# Altium schematic sheet stc-mainboard.SchDoc
size A1
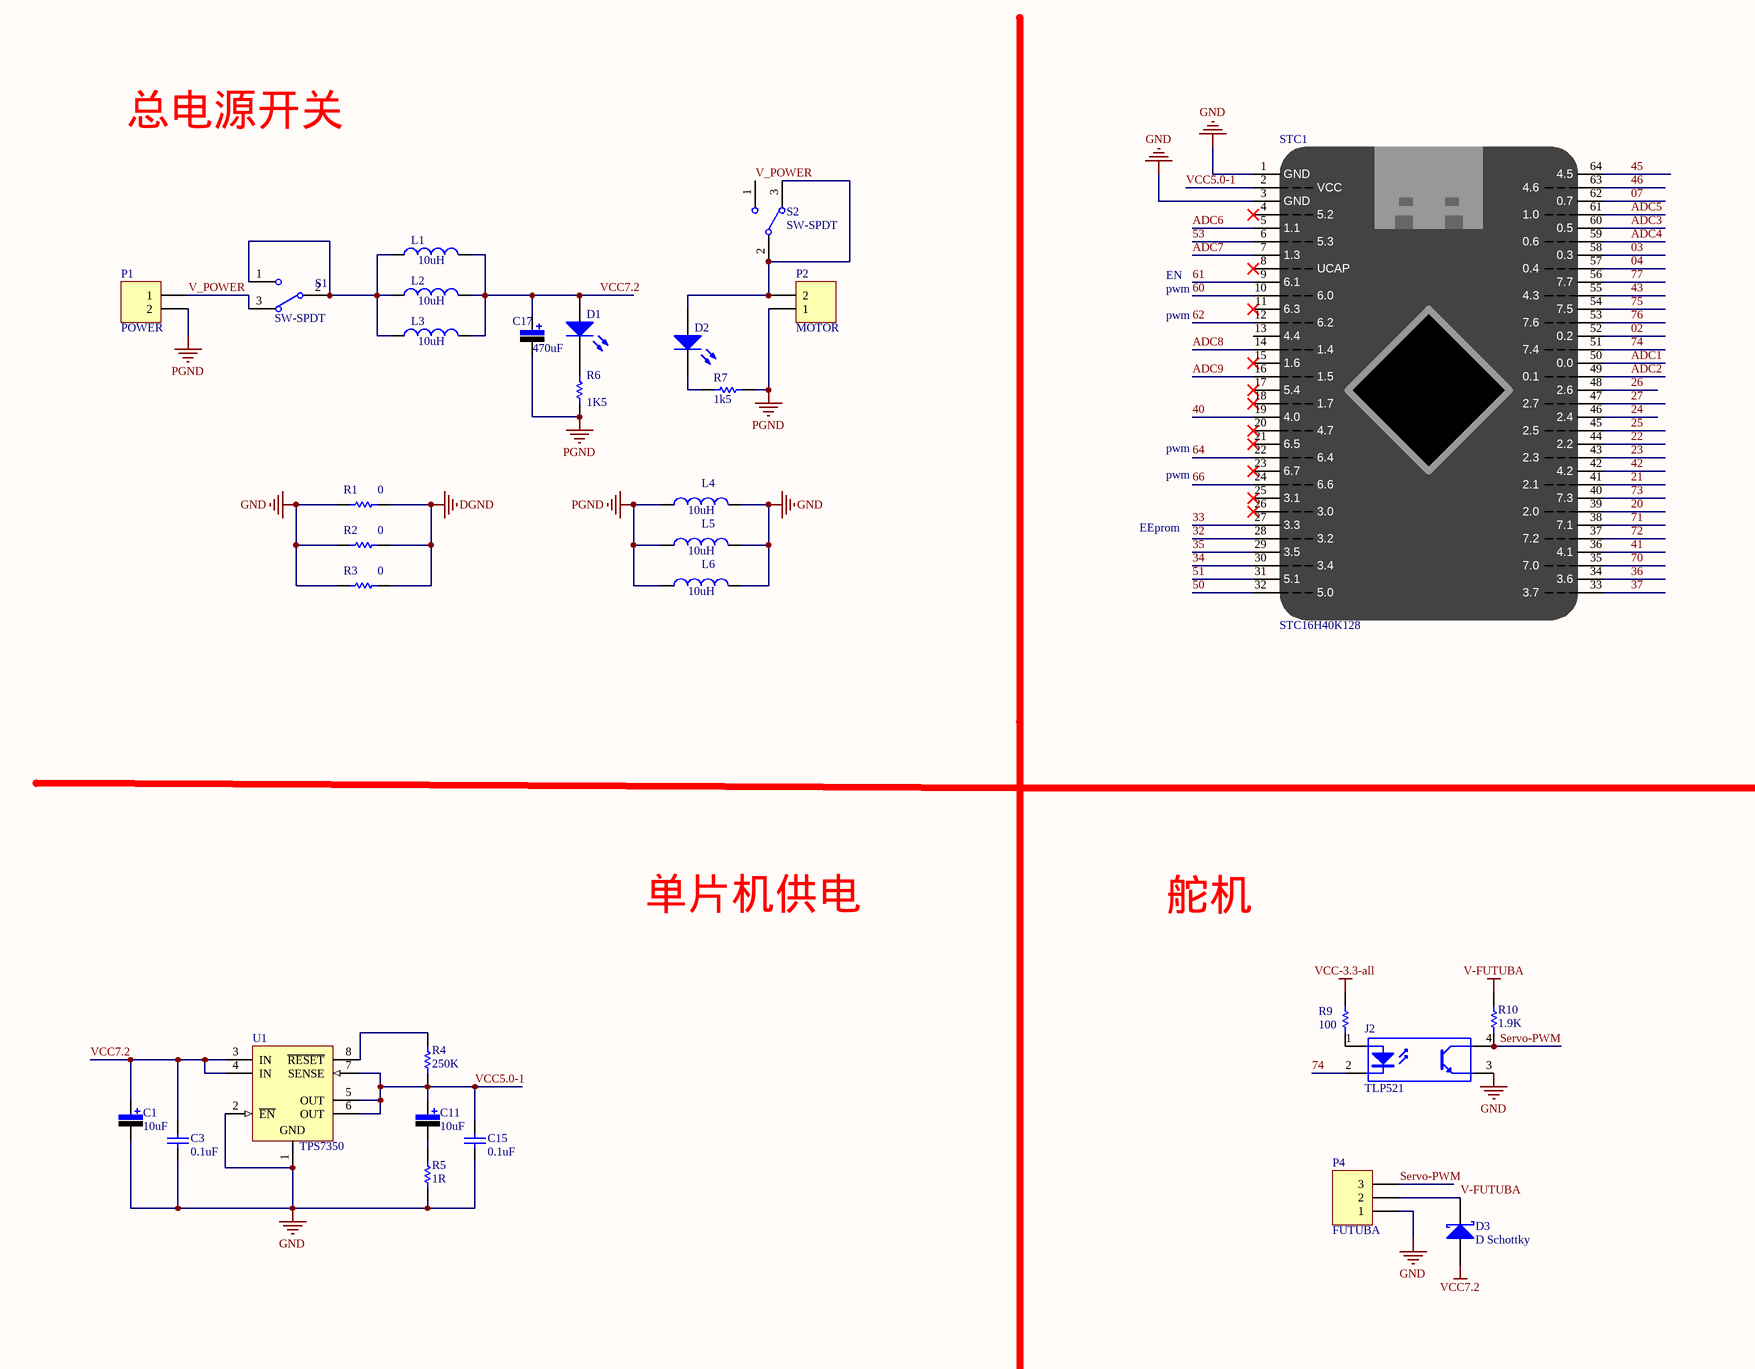
[diagram p0: stc-mainboard.SchDoc, top left]
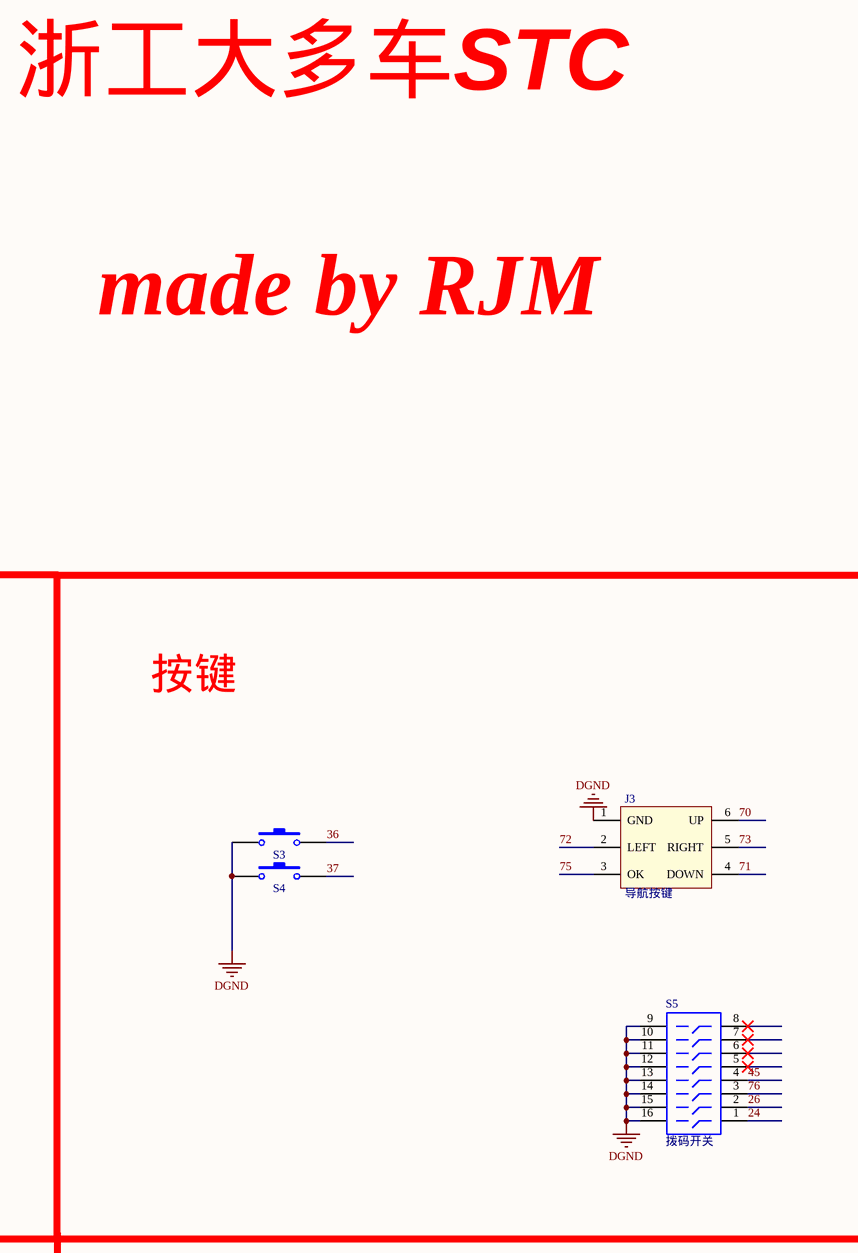
[diagram p1: stc-mainboard.SchDoc, top right]
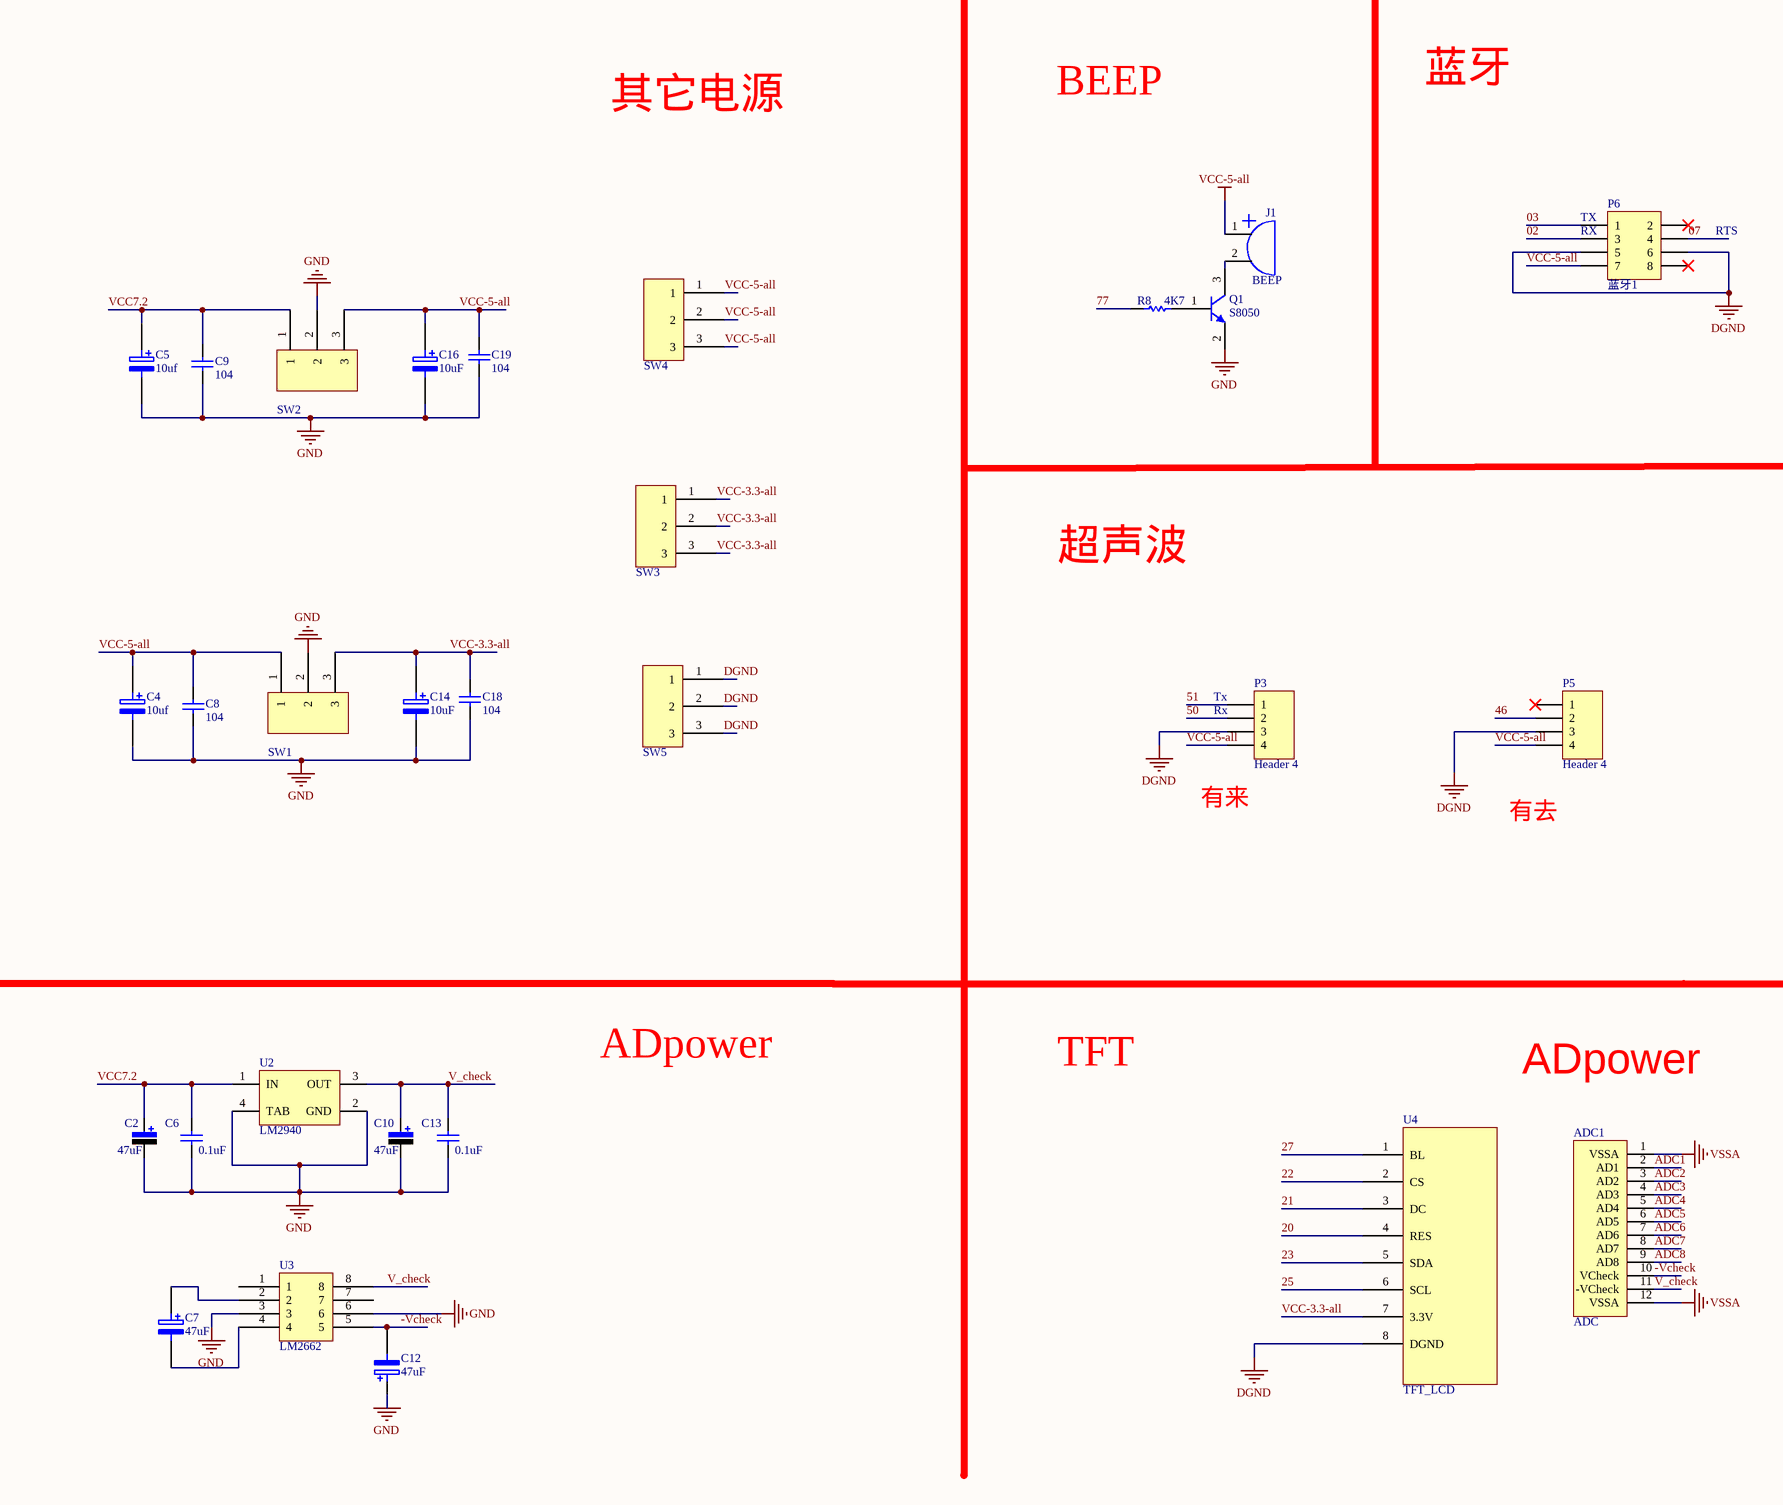
[diagram p2: stc-mainboard.SchDoc, bottom left]
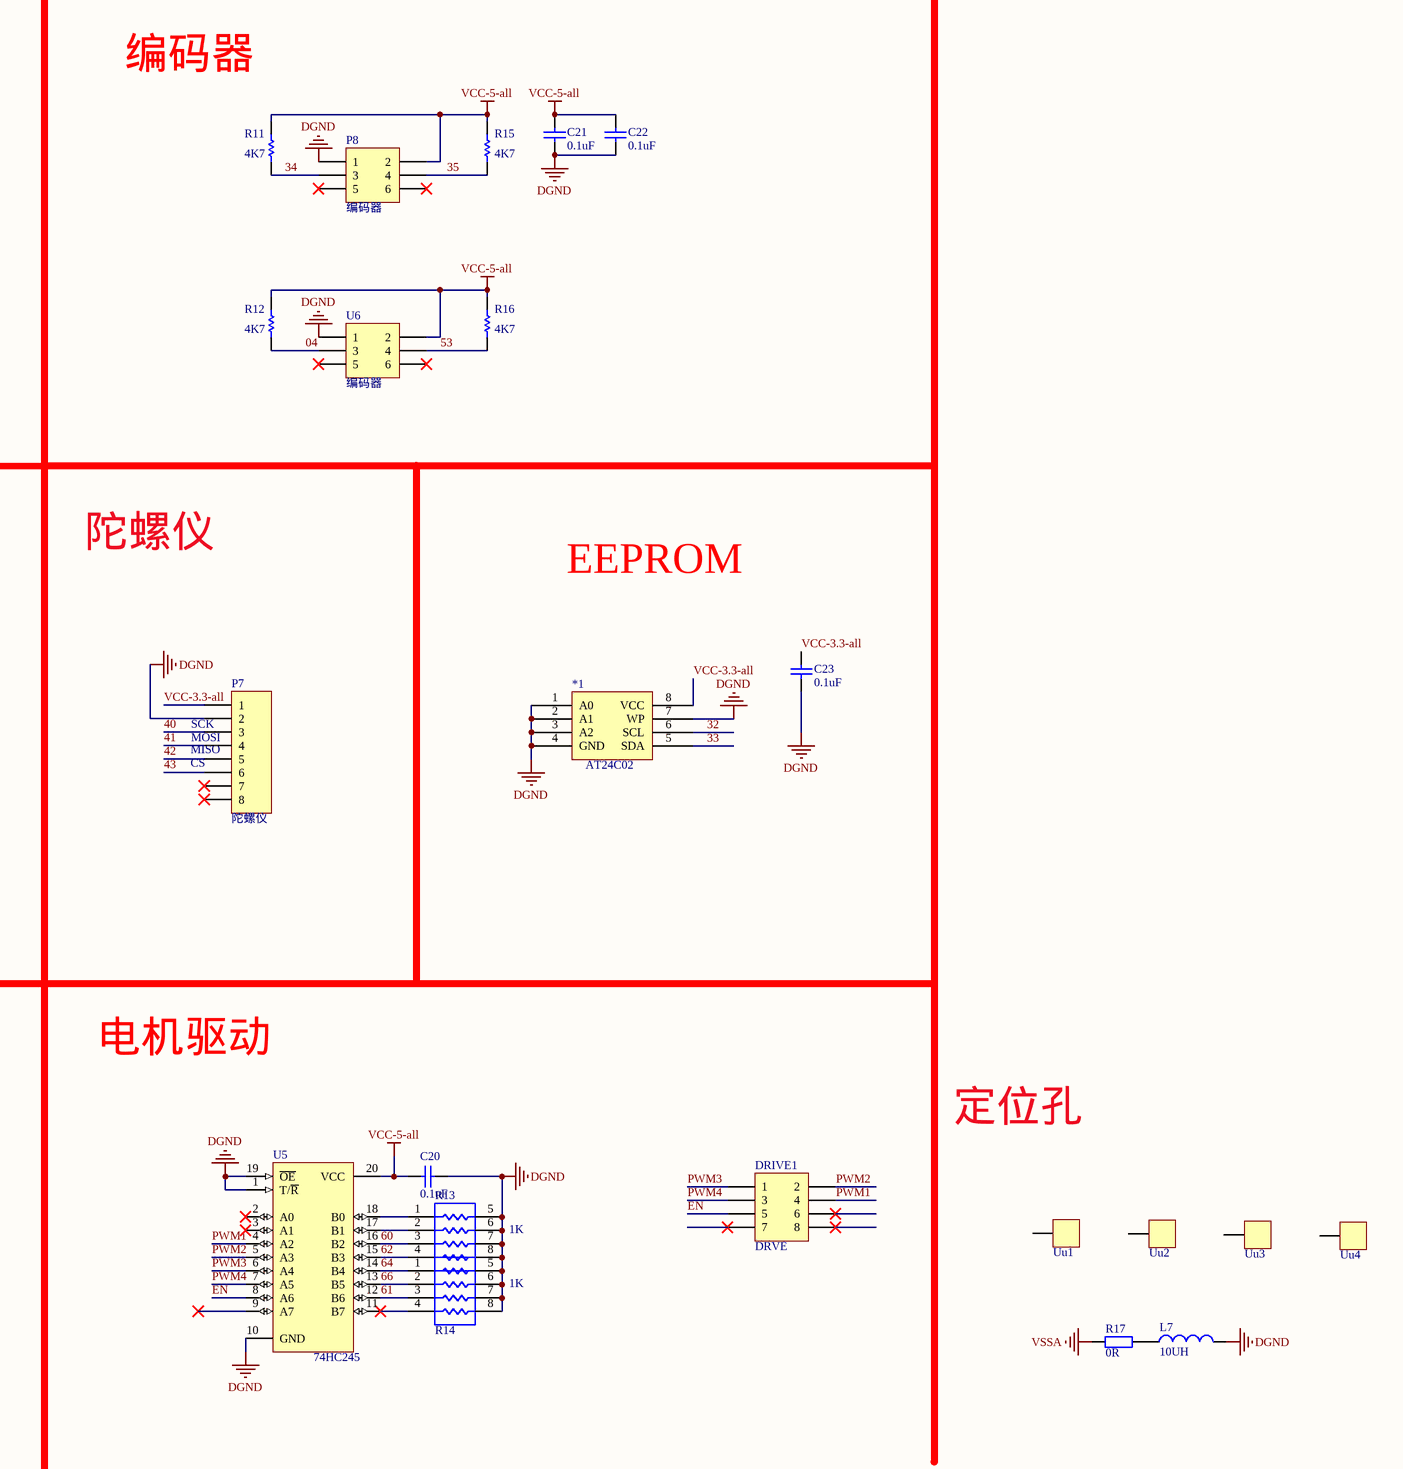
[diagram p3: stc-mainboard.SchDoc, bottom right]

## Parts
*1  Component_1  [LC-SOIC-8_150mil]  (value not drawn)
ADC1  ADC  [HDR2.54-Y-LI-16P]
C1  value 10uF  [LC-CASE-B_3528]  (hidden comment: Cap-Pol)
C2  value 47uF  [LC-CASE-B_3528]  (hidden comment: Cap-Pol)
C3  value 0.1uF  [LC-0805_C]  (hidden comment: Cap)
C4  10uf  [LC-CASE-B_3528]
C5  10uf  [LC-CASE-B_3528]
C6  value 0.1uF  [LC-0805_C]  (hidden comment: Cap)
C7  47uF  [LC-CASE-B_3528]
C8  104  [LC-0805_C]
C9  104  [LC-0805_C]
C10  value 47uF  [LC-CASE-B_3528]  (hidden comment: Cap-Pol)
C11  value 10uF  [LC-CASE-A_3216]  (hidden comment: Cap-Pol)
C12  47uF  [LC-CASE-B_3528]
C13  value 0.1uF  [LC-0805_C]  (hidden comment: Cap)
C14  10uF  [LC-CASE-B_3528]
C15  value 0.1uF  [LC-0805_C]  (hidden comment: Cap)
C16  10uF  [LC-CASE-B_3528]
C17  value 470uF  [C-RB-SD10]  (hidden comment: Cap-Pol-ES)
C18  104  [LC-0805_C]
C19  104  [LC-0805_C]
C20  value 0.1uF  [LC-0805_C]  (hidden comment: Cap)
C21  value 0.1uF  [LC-0805_R]  (hidden comment: Cap)
C22  value 0.1uF  [LC-0805_R]  (hidden comment: Cap)
C23  value 0.1uF  [LC-0603_C]  (hidden comment: Cap)
D1  LED  [LED0805]  (value not drawn)
D2  LED  [LED0805]  (value not drawn)
D3  D Schottky  [LC-SMB(DO-214AA)_S1]
DRIVE1  DRVE  [MHDR2X4]
J1  BEEP  [FMQ-mini]
J2  TLP521  [LC-SOP-4_P2.54]
J3  导航按键  [KEY_5]
L1  value 10uH  [LC-0805_L]  (hidden comment: Inductor)
L2  value 10uH  [LC-0805_L]  (hidden comment: Inductor)
L3  value 10uH  [LC-0805_L]  (hidden comment: Inductor)
L4  value 10uH  [LC-0805_L]  (hidden comment: Inductor)
L5  value 10uH  [LC-0805_L]  (hidden comment: Inductor)
L6  value 10uH  [LC-0805_L]  (hidden comment: Inductor)
L7  10UH  [LC-0805_L]
P1  POWER  [Con 2接线端子]
P2  MOTOR  [Con 2接线端子]
P3  Header 4  [HDR1X4]
P4  FUTUBA  [HDR3X1-2.54]
P5  Header 4  [HDR1X4]
P6  蓝牙1  [HDR2X4]
P7  陀螺仪  [HDR1X8]
P8  编码器  [编码器]
Q1  S8050  [SOT23-3]
R1  value 0  [LC-0805_R]  (hidden comment: Res1)
R2  value 0  [LC-0805_R]  (hidden comment: Res1)
R3  value 0  [LC-0805_R]  (hidden comment: Res1)
R4  value 250K  [LC-0805_R]  (hidden comment: Res1)
R5  value 1R  [LC-0805_R]  (hidden comment: Res1)
R6  value 1K5  [LC-0805_R]  (hidden comment: Res1)
R7  value 1k5  [LC-0805_R]  (hidden comment: Res1)
R8  value 4K7  [LC-0805_R]  (hidden comment: Res1)
R9  value 100  [LC-0805_R]  (hidden comment: Res1)
R10  value 1.9K  [LC-0805_R]  (hidden comment: Res1)
R11  value 4K7  [LC-0805_R]  (hidden comment: Res1)
R12  value 4K7  [LC-0805_R]  (hidden comment: 4.7k)
R13  value 1K  [LC-0603_Rx4]  (hidden comment: Res Pack)
R14  value 1K  [LC-0603_Rx4]  (hidden comment: Res Pack)
R15  value 4K7  [LC-0805_R]  (hidden comment: Res1)
R16  value 4K7  [LC-0805_R]  (hidden comment: 4.7k)
R17  value 0R  [LC-0805_L]  (hidden comment: 0k)
S1  SW-SPDT  [纽子开关]
S2  SW-SPDT  [纽子开关]
S3  SW-PB  [SW_PB2_A1]  (value not drawn)
S4  SW-PB  [SW_PB2_A1]  (value not drawn)
S5  拨码开关  [DIP-16-KEY]
STC1  STC16H40K128  [STC16H40K128_CoreBoard]
SW1  Switch  [LC-TO-263-3]  (value not drawn)
SW2  Switch  [LC-TO-263-3]  (value not drawn)
SW3  Switch  [HDR3X1_2.54_3pin]  (value not drawn)
SW4  Switch  [HDR3X1_2.54_3pin]  (value not drawn)
SW5  Switch  [HDR3X1_2.54_3pin]  (value not drawn)
U1  TPS7350  [LC-SOIC-8_150mil]
U2  LM2940  [LC-SOT-223]
U3  LM2662  [LC-SOIC-8_150mil]
U4  TFT_LCD  [TFT1.8]
U5  74HC245  [TSSOP20]
U6  编码器  [编码器]
Uu1  定位孔  [定位孔]  (value not drawn)
Uu2  定位孔  [定位孔]  (value not drawn)
Uu3  定位孔  [定位孔]  (value not drawn)
Uu4  定位孔  [定位孔]  (value not drawn)

## Nets
DGND: *1.1(A0) *1.2(A1) *1.3(A2) *1.4(GND) *1.7(WP) C20.1 C21.1 C22.1 C23.1 J3.1(GND) L7.2 P3.3 P5.3 P6.5 P6.6 P7.2 P8.1 R1.2 R2.2 R3.2 R13.5 R13.6 R13.7 R13.8 R14.5 R14.6 R14.7 R14.8 S3.1 S4.1 S5.9 S5.10 S5.11 S5.12 S5.13 S5.14 S5.15 S5.16 SW5.1 SW5.2 SW5.3 U4.8(DGND) U5.1(T/~{R}) U5.10(GND) U5.19(~{OE}) U6.1
GND: C1.2 C2.2 C3.1 C4.2 C5.2 C6.1 C8.1 C9.1 C10.2 C12.1 C13.1 C14.2 C15.1 C16.2 C18.1 C19.1 J2.3(E) L4.2 L5.2 L6.2 P4.1 Q1.2(E) R1.1 R2.1 R3.1 R5.1 STC1.1(GND) STC1.3(GND) SW1.2 SW2.2 U1.1(GND) U1.2(~{EN}) U2.2(GND) U2.4(TAB) U3.3 U3.6
PGND: C17.2 L4.1 L5.1 L6.1 P1.2 P2.1 R6.1 R7.1
V-FUTUBA: D3.2(K) P4.2 R10.1
VCC7.2: C1.1 C2.1 C3.2 C5.1 C6.2 C9.2 C17.1 D1.1(A) D3.1(A) L1.2 L2.2 L3.2 SW2.1 U1.3(IN) U1.4(IN) U2.1(IN)
VCC-3.3-all: *1.8(VCC) C14.1 C18.2 C23.2 P7.1 R9.2 SW1.3 SW3.1 SW3.2 SW3.3 U4.7(3.3V)
VCC-5-all: C4.1 C8.2 C16.1 C19.2 C20.2 C21.2 C22.2 J1.1 P3.4 P5.4 P6.7 P8.2 R11.1 R12.1 R15.1 R16.1 SW1.1 SW2.3 SW4.1 SW4.2 SW4.3 U5.20(VCC) U6.2
VSSA: ADC1.1(VSSA) ADC1.12(VSSA) R17.1
02: P6.3 STC1.52(0.2)
03: P6.1 STC1.58(0.3)
04: R12.2 STC1.57(0.4) U6.3
07: P6.4 STC1.62(0.7)
20: STC1.39(2.0) U4.4(RES)
21: STC1.41(2.1) U4.3(DC)
22: STC1.44(2.2) U4.2(CS)
23: STC1.43(2.3) U4.5(SDA)
24: S5.1 STC1.46(2.4)
25: STC1.45(2.5) U4.6(SCL)
26: S5.2 STC1.48(2.6)
27: STC1.47(2.7) U4.1(BL)
32: *1.6(SCL) STC1.28(3.2)
33: *1.5(SDA) STC1.27(3.3)
34: P8.3 R11.2 STC1.30(3.4)
35: P8.4 R15.2 STC1.29(3.5)
36: S3.2 STC1.34(3.6)
37: S4.2 STC1.33(3.7)
40: P7.3 STC1.19(4.0)
41: P7.4 STC1.36(4.1)
42: P7.5 STC1.42(4.2)
43: P7.6 STC1.55(4.3)
45: S5.4 STC1.64(4.5)
46: P5.2 STC1.63(4.6)
50: P3.2 STC1.32(5.0)
51: P3.1 STC1.31(5.1)
53: R16.2 STC1.6(5.3) U6.4
60: R13.3 STC1.10(6.0) U5.16(B2)
61: R14.3 STC1.9(6.1) U5.12(B6)
62: R13.4 STC1.12(6.2) U5.15(B3)
64: R14.1 STC1.22(6.4) U5.14(B4)
66: R14.2 STC1.24(6.6) U5.13(B5)
70: J3.6(UP) STC1.35(7.0)
71: J3.4(DOWN) STC1.38(7.1)
72: J3.2(LEFT) STC1.37(7.2)
73: J3.5(RIGHT) STC1.40(7.3)
74: J2.2(K) STC1.51(7.4)
75: J3.3(OK) STC1.54(7.5)
76: S5.3 STC1.53(7.6)
77: R8.2 STC1.56(7.7)
-Vcheck: ADC1.10(VCheck) C12.2 U3.5
ADC1: ADC1.2(AD1) STC1.50(0.0)
ADC2: ADC1.3(AD2) STC1.49(0.1)
ADC3: ADC1.4(AD3) STC1.60(0.5)
ADC4: ADC1.5(AD4) STC1.59(0.6)
ADC5: ADC1.6(AD5) STC1.61(1.0)
ADC6: ADC1.7(AD6) STC1.5(1.1)
ADC7: ADC1.8(AD7) STC1.7(1.3)
ADC8: ADC1.9(AD8) STC1.14(1.4)
ADC9: STC1.16(1.5)
EN: DRIVE1.5 U5.8(A6)
PWM1: DRIVE1.4 U5.4(A2)
PWM2: DRIVE1.2 U5.5(A3)
PWM3: DRIVE1.1 U5.6(A4)
PWM4: DRIVE1.3 U5.7(A5)
Servo-PWM: J2.4(C) P4.3 R10.2
V_check: ADC1.11(-VCheck) C10.1 C13.2 U2.3(OUT) U3.8
V_POWER: P1.1 S1.3 S2.1
VCC5.0-1: C11.1 C15.2 R4.1 STC1.2(VCC) U1.5(OUT) U1.6(OUT) U1.7(SENSE)
NetC7_1: C7.1 U3.2
NetC7_2: C7.2 U3.4
NetC11_2: C11.2 R5.2
NetD1_2: D1.2(K) R6.2
NetD2_1: D2.1(A) P2.2 S2.2 S2.3
NetD2_2: D2.2(K) R7.2
NetJ1_2: J1.2 Q1.3(C)
NetJ2_1: J2.1(A) R9.1
NetL1_1: L1.1 L2.1 L3.1 S1.1 S1.2
NetL7_1: L7.1 R17.2
NetQ1_1: Q1.1(B) R8.1
NetR4_2: R4.2 U1.8(~{RESET})
NetR13_1: R13.1 U5.18(B0)
NetR13_2: R13.2 U5.17(B1)
NetR14_4: R14.4 U5.11(B7)

Not connected (* = marked no-connect by the designer): DRIVE1 6* 7* 8*; P5 1*; P6 2* 8*; P7 7* 8*; P8 5* 6*; S5 5* 6* 7* 8*; STC1 4(5.2)* 8(UCAP)* 11(6.3)* 13(4.4) 15(1.6)* 17(5.4)* 18(1.7)* 20(4.7)* 21(6.5)* 23(6.7)* 25(3.1)* 26(3.0)*; U3 1 7; U5 2(A0)* 3(A1)* 9(A7)*; U6 5* 6*; Uu1 1; Uu2 1; Uu3 1; Uu4 1

## Notes on the sheet
- 总电源开关
- pwm
- EN
- 浙工大多车STC
- EEprom
- made by RJM
- 单片机供电
- 舵机
- 按键
- 编码器
- 其它电源
- BEEP
- 蓝牙
- (near P6) TX
- (near P6) RX
- RTS
- 陀螺仪
- 超声波
- EEPROM
- (near P3) Tx
- (near P3) Rx
- (near P7) SCK
- (near P7) MISO
- (near P7) CS
- (near P7) MOSI
- (near P3) 有来
- 有去
- ADpower
- 电机驱动
- TFT
- 定位孔
- (in symbol Component_1) AT24C02

## Library data of the parts
C1 C2 C10 C11 = Cap-Pol-A: 钽电容; Published: 8-Jun-2000; LatestRevisionDate: 17-Jul-2002; LatestRevisionNote: Re-released for DXP Platform.; PackageReference: RB7.6-15; Publisher: Altium Limited
C3 C6 C13 C15 C20-C23 = Cap: Capacitor; Published: 8-Jun-2000; LatestRevisionDate: 17-Jul-2002; LatestRevisionNote: Re-released for DXP Platform.; PackageReference: RAD-0.3; Publisher: Altium Limited; PackageDescription: Radial Cap, Thru-Hole; 2 Leads; 0.3 in Pin Spacing
C4 C5 C14 C16 = ELECTRO2: Electrolytic Capacitor
C7 C12 = ELECTRO2_1: Electrolytic Capacitor; Value: 47uF
C8 C9 C18 C19 = CAP-0603
C17 = Cap-Pol-ES: 固态电容; Published: 8-Jun-2000; LatestRevisionDate: 17-Jul-2002; LatestRevisionNote: Re-released for DXP Platform.; PackageReference: RB7.6-15; Publisher: Altium Limited
D1 D2 = LED0: Typical INFRARED GaAs LED; Published: 8-Jun-2000; LatestRevisionDate: 08-Jul-2005; LatestRevisionNote: Mech Layer 1 removed.; PackageReference: LED-0; Publisher: Altium Limited; PackageDescription: LED; 2 Leads
D3 = D Schottky: Schottky Diode; Published: 8-Jun-2000; LatestRevisionDate: 17-Jul-2002; LatestRevisionNote: Re-released for DXP Platform.; PackageReference: SMB; Publisher: Altium Limited; PackageDescription: DO-214-AA/SMB; 2 C-Bend Leads; Body 5.3 x 3.6 mm, inc. leads (LxW); Code_JEDEC: DO-214-AA
DRIVE1 P6 = Header 4X2: 电机驱动接口; LatestRevisionDate: 17-Jul-2002; LatestRevisionNote: Re-released for DXP Platform.; Publisher: Altium Limited
J1 = BEEP-S: 有源蜂鸣器0905
J2 = TLP281: 光耦; Published: 24-Mar-1999; LatestRevisionDate: 04-Mar-2005; LatestRevisionNote: Sch pins 3 & 4 Swapped.; DatasheetDocument: Nov-2003; PackageReference: DIP-4; Publisher: Altium Limited
J3 = KEY_5: 五向导航按键
L1-L6 = Inductor: Code_IEC: 1005; Published: 8-Jun-2000; LatestRevisionDate: 29-May-2009; LatestRevisionNote: IPC-7351 Footprint Added.; PackageReference: 0402-A; Publisher: Altium Limited; PackageDescription: Chip Inductor; Code_JEITA: 0402
L7 = 0805 电感_L
P1 P2 = Header 2: Header, 2-Pin; LatestRevisionDate: 17-Jul-2002; LatestRevisionNote: Re-released for DXP Platform.; Publisher: Altium Limited
P3 P5 = Header 4: Header, 4-Pin; LatestRevisionDate: 17-Jul-2002; LatestRevisionNote: Re-released for DXP Platform.; Publisher: Altium Limited
P4 = Header 3: Header, 3-Pin; LatestRevisionDate: 17-Jul-2002; LatestRevisionNote: Re-released for DXP Platform.; Publisher: Altium Limited
P7 = Header 8: Header, 8-Pin; LatestRevisionDate: 17-Jul-2002; LatestRevisionNote: Re-released for DXP Platform.; Publisher: Altium Limited
P8 U6 = Header 3X2: 光电编码器接口; LatestRevisionDate: 17-Jul-2002; LatestRevisionNote: Re-released for DXP Platform.; Publisher: Altium Limited
Q1 = SS9014: NPN贴片三极管; Published: 8-Jun-2000; LatestRevisionDate: 15-Jan-2003; LatestRevisionNote: PCB Footprint 'BCY-W3/D4.7' replaced; DatasheetDocument: 1997; PackageDocument: Sep-1998; PackageReference: TO-92A; Publisher: Altium Limited; Code_JEDEC: TO-92A; ComponentLink1Description: Manufacturer Link; ComponentLink1URL: http://www.fairchildsemi.com/; ComponentLink2Description: Datasheet; ComponentLink2URL: http://www.fairchildsemi.com/ds/2N%2F2N3904.pdf
R1-R12 R15 R16 = Res1: Resistor; Published: 8-Jun-2000; LatestRevisionDate: 17-Jul-2002; LatestRevisionNote: Re-released for DXP Platform.; PackageReference: AXIAL-0.3; Publisher: Altium Limited; PackageDescription: Axial Device, Thru-Hole; 2 Leads; 0.3 in Pin Spacing
R13 R14 = Res Pack: Isolated Resistor Network; Published: 24-Mar-1999; LatestRevisionDate: 29-May-2009; LatestRevisionNote: IPC-7351 Footprint Added.; PackageReference: SO-16; Publisher: Altium Limited; PackageDescription: 16-Pin Small Outline Integrated Circuit 1.27 mm Pitch; Code_JEDEC: MS-012-AC; Code_IPC: SOIC127P600-16
R17 = Res_L: Resistor; Published: 8-Jun-2000; LatestRevisionDate: 17-Jul-2002; LatestRevisionNote: Re-released for DXP Platform.; PackageReference: AXIAL-0.4; Publisher: Altium Limited
S1 S2 = SW-SPDT: SPDT Subminiature Toggle Switch, Right Angle Mounting, Vertical Actuation; Published: 24-Mar-1999; LatestRevisionDate: 17-Dec-2003; LatestRevisionNote: Schematic revised, PCB Footprint replaced.; DatasheetVersion: 05-Dec-2000; PackageReference: TL36WW15050; Publisher: Altium Limited; PackageDescription: Switch; 4 Leads; ComponentLink1Description: Manufacturer Link; ComponentLink1URL: http://www.apem.com
S3 S4 = SW-PB: 两脚贴片微动开关; Published: 24-Mar-1999; LatestRevisionDate: 17-Jul-2002; LatestRevisionNote: Re-released for DXP Platform.; PackageReference: SPST-2; Publisher: Altium Limited
S5 = SW-DIP8: 八位拨码开关; Published: 24-Mar-1999; LatestRevisionDate: 17-Dec-2003; LatestRevisionNote: PCB Footprint replaced.; PackageReference: DIP-16-KEY; Publisher: Altium Limited; PackageDescription: DIP; 16 Leads; Row Spacing 7.62 mm; Pitch 2.54 mm; ComponentLink1Description: Manufacturer Link; ComponentLink1URL: http://www.oupiin.com/prodindx.html#Headers
STC1 = STC16H40K128_CoreBoard: 逐飞科技 STC16H40K128核心板
SW1-SW5 = 3
U1 = TPS7350QD: Single Output LDO, 500 mA, Fixed 5 V Output, 5.33 to 10 V Input, with Integrated SVS, 8-pin SOIC (D), -40 to 125 degC, Green (RoHS & no Sb/Br); Manufacturer: Texas Instruments; Fixed Output Options(V): 5; Iout(Max)(A): 0.5; Iq(Typ)(mA): 0.3; SubFamily: Single Channel LDO; Vdo(Typ)(mV): 270; Vin(Max)(V): 10; Vin(Min)(V): 5.33; DatasheetVersion: SLVS124F; PackageVersion: 4040047-3/M; PackageReference: D8; PackageDescription: 8-Pin Plastic Small Outline, Body 4.9 x 3.9 mm, Pitch 1.27 mm; Supplier 1: Digi-Key; Supplier Part Number 1: 296-8069-5-ND; Supplier 2: Farnell; Supplier Part Number 2: 8461147; Supplier 3: Newark; Supplier Part Number 3: 38K8800; Supplier 4: Newark; Supplier Part Number 4: 52F2805; Supplier 5: Mouser; Supplier Part Number 5: 595-TPS7350QD; Eco-Plan: Green (RoHS & no Sb/Br); Vout Adj(Max)(V): 5; Vout Adj(Min)(V): 5; Mounting Technology: Surface Mount; Code_JEDEC: MS-012; PartNumber: TPS7350QD; ComponentLink1Description: Manufacturer URL; ComponentLink1URL: http://www.ti.com/; ComponentLink2Description: Datasheet; ComponentLink2URL: http://www.ti.com/general/docs/lit/getliterature.tsp?genericPartNumber=TPS7350&fileType=pdf; ComponentLink3Description: Package Specification; ComponentLink3URL: http://www.ti.com/litv/pdf/msoi002j
U2 = LM2940IMP-5.0: 1A Low Dropout Regulator; Manufacturer: National Semiconductor; CompType: LDO IC; PackageTopMarking: XYTT*L53B; PowerWise: N; Published: 4-Dec-2008; DatasheetVersion: Jan-2007; PackageVersion: revB, Apr-2003; PackageReference: MP04A; Publisher: Altium Limited; PackageDescription: Molded SOT-223, 6.50 x 3.56 x 1.6mm Body, 4 Lead, 2.3mm Pitch; PartNumber: LM2940IMP-5.0; RoHS: O; PinCount: 4; DigiKeyPartNumber: LM2940IMP-5.0TR-ND; Code_JEDEC: TO-261-AA; Code_IPC: SOT223-4; ComponentLink1Description: LM2940 Datasheet; ComponentLink1URL: http://www.national.com/ds/LM/LM2940.pdf; ComponentLink2Description: LM2940 Web Page; ComponentLink2URL: http://www.national.com/pf/LM/LM2940.html; ComponentLink3Description: MP04A Package Page; ComponentLink3URL: http://www.national.com/packaging/folders/mp04a.html
U5 = SN74LVC245DW: Octal Bus Transceiver with 3-State Outputs; ComponentAvailability: Obsolete; Published: 8-Jun-2000; LatestRevisionDate: 13-Apr-2006; LatestRevisionNote: IPC-7351 Footprint Added.; DatasheetVersion: Jul-1994; PackageVersion: Mar-2000; PackageReference: DW020; Publisher: Altium Limited; PackageDescription: 20-Pin Plastic Small Outline Integrated Circuit 1.27 mm Pitch; Code_JEDEC: MS-013; Code_IPC: SOIC127P1030-20; ComponentLink1Description: Manufacturer Link; ComponentLink1URL: http://www.ti.com/; ComponentLink2Description: URL Link1; ComponentLink2URL: http://focus.ti.com/docs/prod/folders/print/sn74lvc245.html